# EAGLE design SOIC8-TSSOP8 (EAGLE 7.3.0)
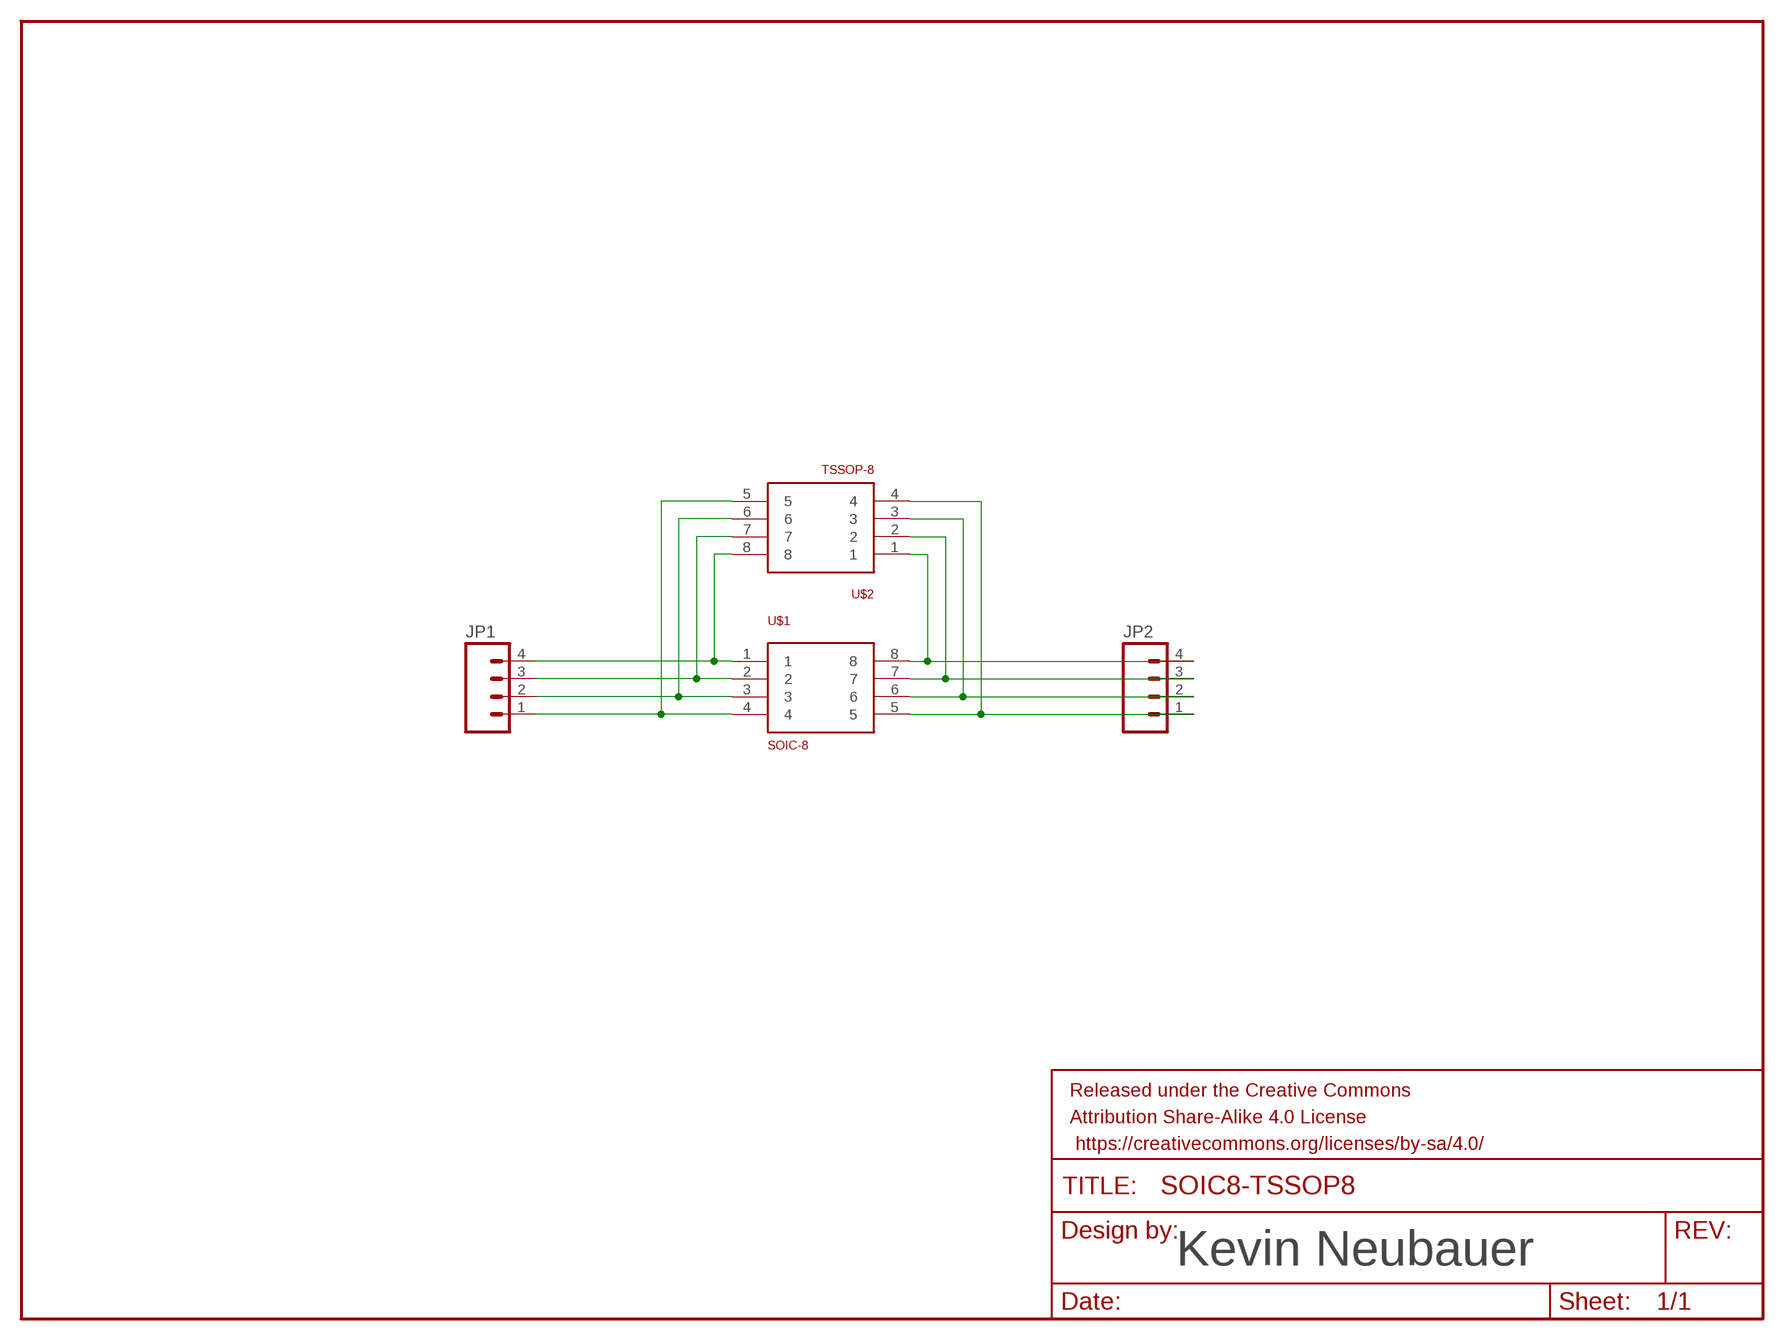
[diagram p0: schematic, sheet 1]

## Parts
FRAME1  FRAME-LETTER  [CREATIVE_COMMONS]
JP1  M04PTH  [1X04]
JP2  M04PTH  [1X04]
U$1  SOIC-8  [SOIC-8]
U$2  TSSOP-8  [TSSOP8]

## Nets
N$1: JP1.4 U$1.1 U$2.8
N$2: JP1.3 U$1.2 U$2.7
N$3: JP1.2 U$1.3 U$2.6
N$4: JP1.1 U$1.4 U$2.5
N$11: JP2.4 U$1.8 U$2.1
N$12: JP2.3 U$1.7 U$2.2
N$13: JP2.2 U$1.6 U$2.3
N$14: JP2.1 U$1.5 U$2.4

## Notes on the sheet
- Kevin Neubauer

## Library data of the parts
FRAME1 = SparkFun-Aesthetics:FRAME-LETTER: Schematic Frame Standard 8.5x11 US Letter frame
JP1 JP2 = SparkFun-Connectors:M04: Header 4 Standard 4-pin 0.1" header. Use with straight break away headers (SKU : PRT-00116), right angle break away headers (PRT-00553), swiss pins (PRT-00743), machine pins (PRT-00117), and female headers (PRT-00115). Molex polarized connector foot print use with SKU : PRT-08231 with associated crimp pins and housings. 1MM SMD Version SKU: PRT-10208
U$1 = Kevin-GenericICFootprints:SOIC-8
U$2 = Kevin-GenericICFootprints:TSSOP-8

## Board
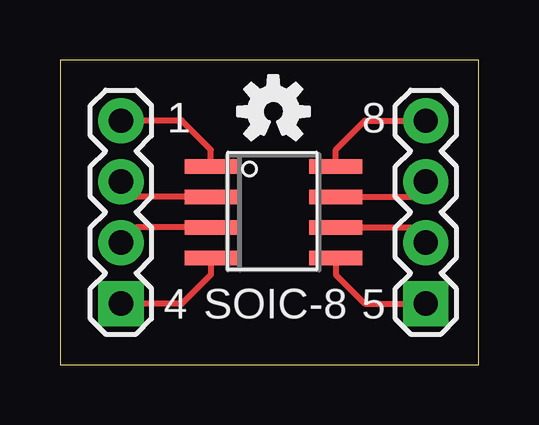
[diagram p1: board, top side]
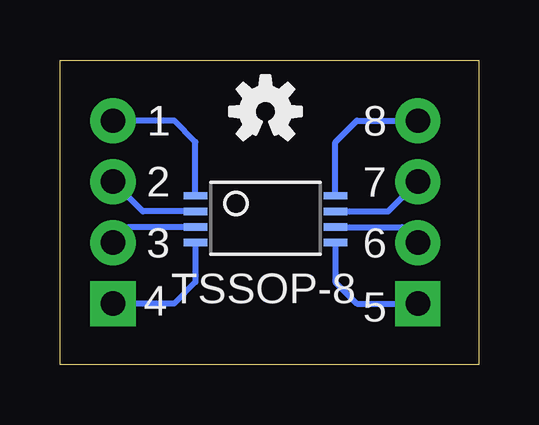
[diagram p2: board, bottom side, seen from below]

Size 17.45 x 12.69 mm. Coordinates in mm from the lower left corner, seen from the top.
Outline: 0,0 17.45,0 17.45,12.69 0,12.69 0,0
Copper layers (1*16): Top 0.035mm / dielectric 1.5mm / Bottom 0.035mm
Design rules "dirt_cheap_dirty_boards.v1": minimum track width 5mil, minimum drill 12mil, track to track 5mil, track to pad 5mil, pad to pad 5mil, via to via 5mil, smd to smd 0mil, copper to edge 10mil, drill to drill 10mil, minimum pad ring 10mil, minimum via ring 6mil, stop-mask expansion 2mil, vias tented up to drill 25mil, thermal gap 10mil

### Footprints (pad centres in the part's own frame; a part is rotated, then mirrored left to right if it is on the bottom)
1X04 = drill 1.016 pad 1.88 square: 1 0,0 | drill 1.016 pad 1.88: 2 2.54,0; 3 5.08,0; 4 7.62,0
SOIC-8 = smd 0.6 x 2.2: 1 -1.905,-2.6; 2 -0.635,-2.6; 3 0.635,-2.6; 4 1.905,-2.6; 5 1.905,2.6; 6 0.635,2.6; 7 -0.635,2.6; 8 -1.905,2.6
TSSOP8 = smd 0.305 x 0.991: 1 -0.68,-2.918; 2 -0.03,-2.918; 3 0.62,-2.918; 4 1.27,-2.918; 5 1.27,2.918; 6 0.62,2.918; 7 -0.03,2.918; 8 -0.68,2.918

### Placement (x,y rotation side)
FRAME1  -9.65,-17.98 0 top  (outside the outline)
JP1  2.54,2.54 90 top
JP2  15.24,2.54 90 top
U$1  8.89,6.35 270 top
U$2  8.89,6.35 270 bottom
U$3  [OSHW-LOGO-S]  8.89,10.54 0 top
U$4  [OSHW-LOGO-S]  8.89,10.54 0 bottom

### Tracks (layer width: path | path; a pad name or v marks a point on that pad's centre or on a via)
N$1
  Top 0.254: U$1.1 6.29,8.95 5.08,10.16 JP1.4
  Bottom 0.254: U$2.8 5.97,9.27 5.08,10.16 JP1.4
N$2
  Top 0.254: U$1.2 3.17,6.99 JP1.3
  Bottom 0.254: U$2.7 3.78,6.38 JP1.3
N$3
  Top 0.254: U$1.3 3.17,5.71 JP1.2
  Bottom 0.254: U$2.6 3.19,5.73 JP1.2
N$4
  Top 0.254: U$1.4 6.29,3.75 5.08,2.54 JP1.1
  Bottom 0.254: U$2.5 5.97,3.43 5.08,2.54 JP1.1
N$11
  Top 0.254: U$1.8 11.49,8.95 12.7,10.16 JP2.4
  Bottom 0.254: U$2.1 11.81,9.27 12.7,10.16 JP2.4
N$12
  Top 0.254: U$1.7 14.61,6.99 JP2.3
  Bottom 0.254: U$2.2 14,6.38 JP2.3
N$13
  Top 0.254: U$1.6 14.61,5.71 JP2.2
  Bottom 0.254: U$2.3 14.59,5.73 JP2.2
N$14
  Top 0.254: U$1.5 11.49,3.75 12.7,2.54 JP2.1
  Bottom 0.254: U$2.4 11.81,3.43 12.7,2.54 JP2.1

### Text on the board
tPlace: 1 | 8 | 4 | SOIC-8 | 5
bPlace: 8 | 1 | 7 | 2 | 6 | 3 | TSSOP-8 | 5 | 4
tDocu: Kevin Neubauer